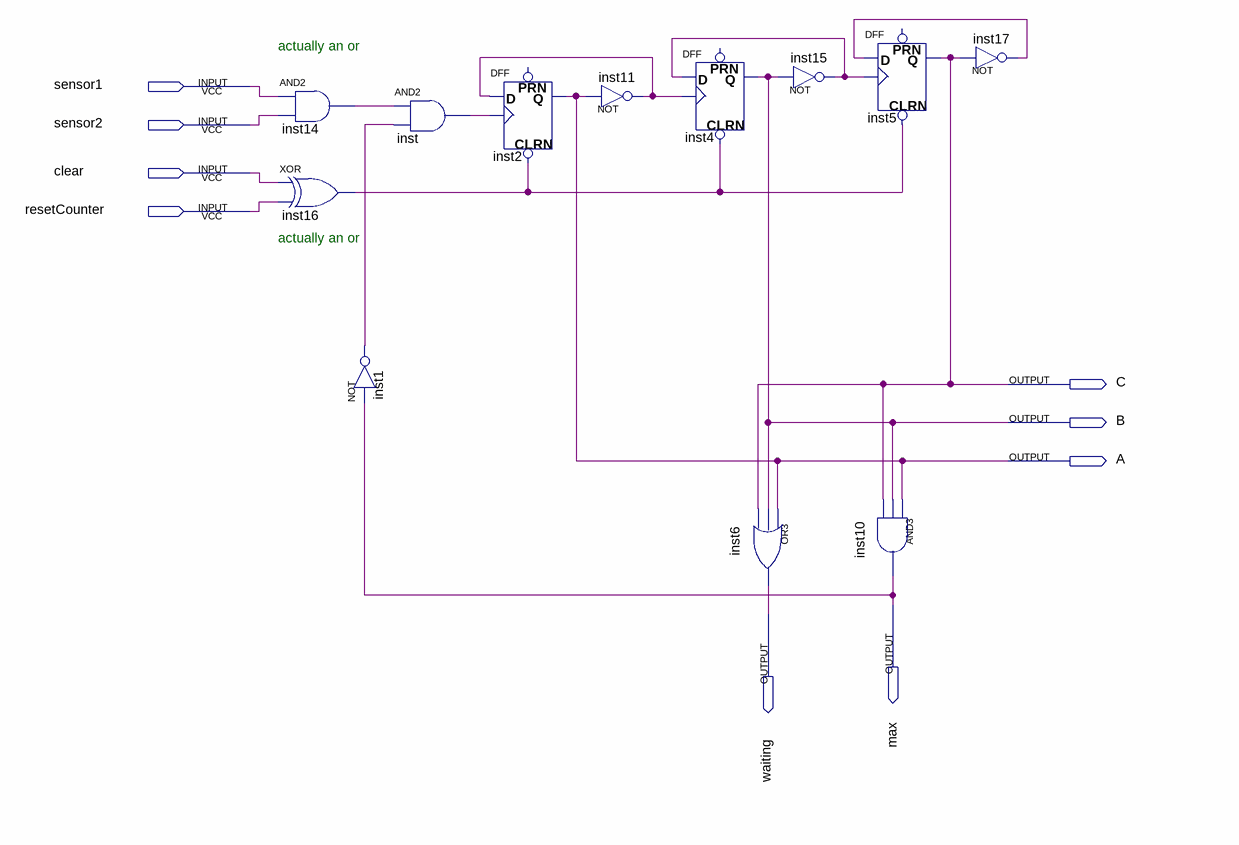
[diagram p0: schematic sheet]
// Quartus schematic PC.bdf as structural Verilog: 12 symbols, 9 pins
module PC (
  input  sensor1,
  input  sensor2,
  input  clear,
  input  resetCounter,
  output C,
  output B,
  output A,
  output max,
  output waiting
);

  wire inst1_out, inst11_out, inst14_out, inst15_out, inst16_out, inst17_out, inst_out;

  and inst14 (inst14_out, sensor1, sensor2);
  xor inst16 (inst16_out, clear, resetCounter);
  and inst (inst_out, inst14_out, inst1_out);
  not inst1 (inst1_out, max);
  DFF inst2 (.CLRN(inst16_out), .CLK(inst_out), .D(inst11_out), .Q(A));  // open: PRN
  not inst11 (inst11_out, A);
  DFF inst4 (.CLRN(inst16_out), .CLK(inst11_out), .D(inst15_out), .Q(B));  // open: PRN
  not inst15 (inst15_out, B);
  or inst6 (waiting, A, B, C);
  DFF inst5 (.CLRN(inst16_out), .CLK(inst15_out), .D(inst17_out), .Q(C));  // open: PRN
  and inst10 (max, A, B, C);
  not inst17 (inst17_out, C);

  // Notes on the sheet:
  //   actually an or
  //   actually an or
endmodule
